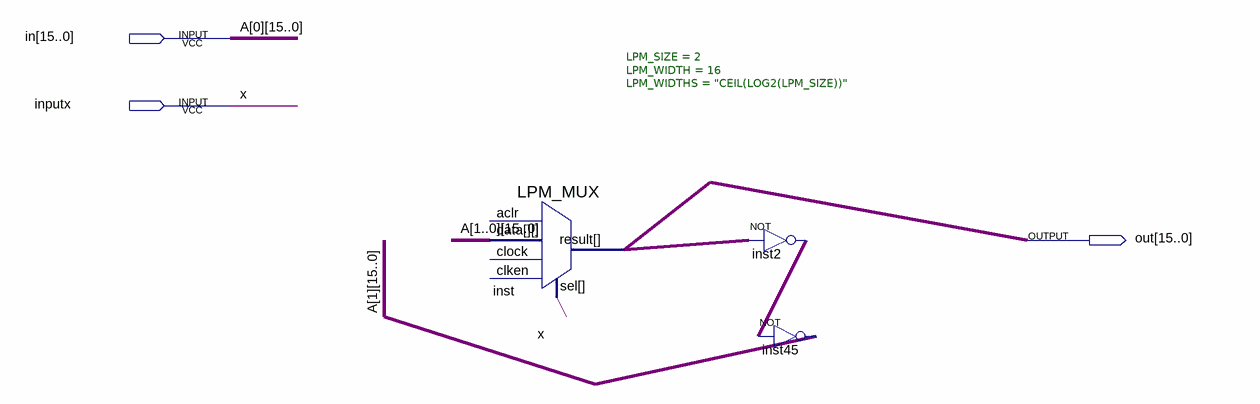
[diagram p0: schematic sheet]
// Quartus schematic aaaaa.bdf as structural Verilog: 3 symbols, 3 pins
module aaaaa (
  input  [15:0] in,
  input  inputx,
  output [15:0] out
);

  wire [15:0] A_1, inst2_out;

  LPM_MUX #(.LPM_SIZE(2), .LPM_WIDTH(16), .LPM_WIDTHS("CEIL(LOG2(LPM_SIZE))")) inst (
    .data({A_1, in}), .sel(inputx), .result(out));  // open: clock, aclr, clken
  assign inst2_out = ~out;  // NOT inst2, 16 bits wide
  assign A_1 = ~inst2_out;  // NOT inst45, 16 bits wide

  // Other names for the same wires on the sheet: A_0[15:0] = in; x = inputx
endmodule
